# Altium project ECG_DAQ.PrjPcb
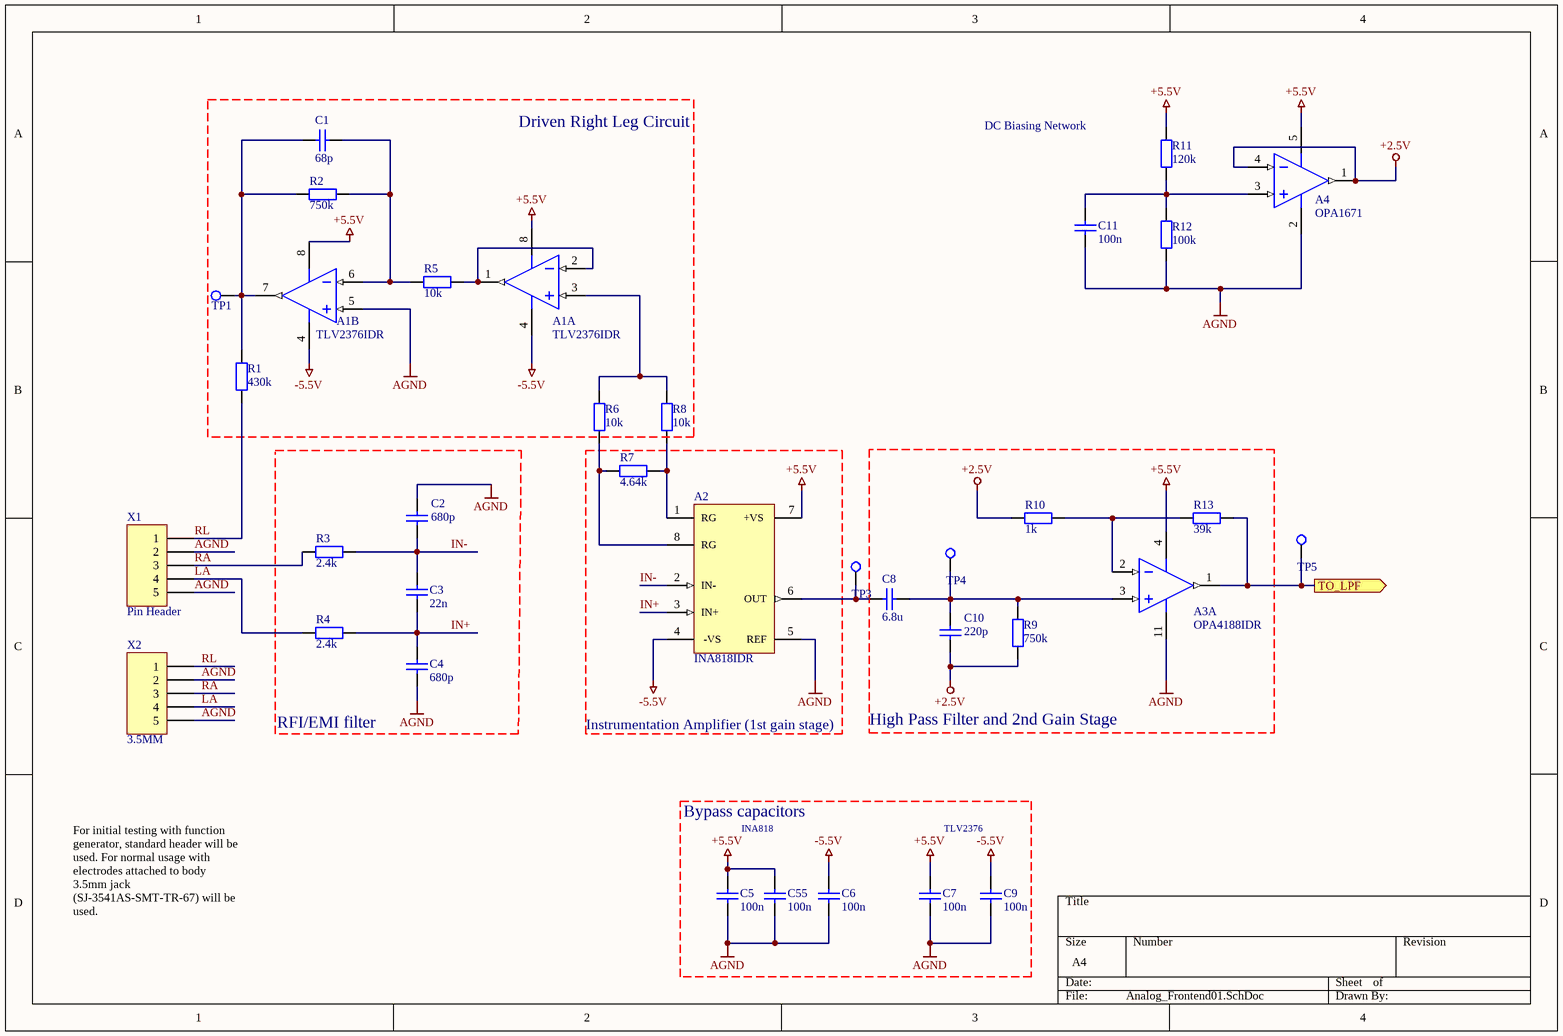
[diagram p0: Analog_Frontend01.SchDoc]
Desiger/Author: Dino Cindric; PCB Layers: 4; PCB Manufacturer 1: JLCPCB; PCB Manufacturer 2: PCBWay; Project Name: ECG Data Acquisition System; Year: 2020
6 sheets, 146 parts. Net scope: flat (ports and power ports of the same name join across sheets).
Board file: ECG-DAQ.PcbDoc
Sheets:
  Analog_Frontend01.SchDoc
  Analog_Frontend02.SchDoc
  MCU.SchDoc
  Power supply.SchDoc
  ADC.SchDoc
  MCU_Supply.SchDoc

## Sheet Analog_Frontend01.SchDoc
size A4; DocumentNumber: 2; SheetNumber: 1; SheetTotal: 5

### Parts
A1  TLV2376IDR  [SOIC127P600X175-8N]  (parts A,B of 2)
A2  INA818IDR  [SOIC127P600X175-8N]
A3  OPA4188IDR  [SOIC127P600X175-14N]  (part A of 4)
A4  OPA1671  [SOT95P280X145-5N]
C1  68p  [CAPC1608X87N]
C2  680p  [CAPC2012X110N]
C3  22n  [CAPC3225X170N]
C4  680p  [CAPC2012X110N]
C5  100n  [CAPC1608X87N]
C6  100n  [CAPC1608X87N]
C7  100n  [CAPC1608X87N]
C8  6.8u  [CAPC2012X110N]
C9  100n  [CAPC1608X87N]
C10  220p  [CAPC1608X87N]
C11  100n  [CAPC1608X87N]
C55  100n  [CAPC1608X87N]
R1  430k  [RESC1608X55N]
R2  750k  [RESC1608X55N]
R3  2.4k  [RESC2012X70N]
R4  2.4k  [RESC2012X70N]
R5  10k  [RESC1608X55N]
R6  10k  [RESC1608X55N]
R7  4.64k  [RESC1608X55N]
R8  10k  [RESC1608X55N]
R9  750k  [RESC1608X55N]
R10  1k  [RESC1608X55N]
R11  120k  [RESC1608X55N]
R12  100k  [RESC1608X55N]
R13  39k  [RESC1608X55N]
TP1  TP  [TEST-POINT]  (value not drawn)  (no BOM)
TP3  TP  [TEST-POINT]  (value not drawn)  (no BOM)
TP4  TP  [TEST-POINT]  (value not drawn)  (no BOM)
TP5  TP  [TEST-POINT]  (value not drawn)  (no BOM)
X1  Pin Header  [SHDR5W64P0X250_1X5_1496X650X700P]
X2  3.5MM  [SJ23574ASMTTR]

### Blocks framed on the sheet
Driven Right Leg Circuit: A1 C1 R1 R2 R5 R6 R8 TP1
RFI/EMI filter: C2-C4 R3 R4
Instrumentation Amplifier (1st gain stage): A2 R7
High Pass Filter and 2nd Gain Stage: A3 C8 C10 R9 R10 R13 TP4
Bypass capacitors: C5-C7 C9 C55

### Ports
TO_LPF (out)

### Nets
+2.5V: A4.1(OUT) A4.4(IN-) C10.1 R9.1 R10.1
+5.5V: A1.8(+V) A2.7(+VS) A3.4(+V) A4.5(V+) C5.2 C7.2 C55.2 R11.1
-5.5V: A1.4(-V) A2.4(-VS) C6.2 C9.2
AGND: A1.5(+IN) A2.5(REF) A3.11(-V) A4.2(V-) C2.2 C4.1 C5.1 C6.1 C7.1 C9.1 C11.1 C55.1 R12.2 X1.2 X1.5 X2.2 X2.5
IN+: A2.3(IN+) C3.1 C4.2 R4.2
IN-: A2.2(IN-) C2.1 C3.2 R3.2
LA: R4.1 X1.4 X2.4
RA: R3.1 X1.3 X2.3
RL: R1.1 X1.1 X2.1
NetA1_1: A1.1(OUT) A1.2(-IN) R5.2
NetA1_3: A1.3(+IN) R6.2 R8.2
NetA1_6: A1.6(-IN) C1.1 R2.2 R5.1
NetA1_7: A1.7(OUT) C1.2 R1.2 R2.1 TP1.0
NetA2_1: A2.1(RG) R7.2 R8.1
NetA2_6: A2.6(OUT) C8.2 TP3.0
NetA2_8: A2.8(RG) R6.1 R7.1
NetA3_1: A3.1(OUT_A) R13.2 TP5.0 ; port TO_LPF
NetA3_2: A3.2(-IN_A) R10.2 R13.1
NetA3_3: A3.3(+IN_A) C8.1 C10.2 R9.2 TP4.0
NetA4_3: A4.3(IN+) C11.2 R11.2 R12.1

### Notes on the sheet
- DC Biasing Network
- INA818
- TLV2376
- For initial testing with function generator, standard header will be used. For normal usage with electrodes attached to body 3.5mm jack (SJ-3541AS-SMT-TR-67) will be used.

### Library data of the parts
A1 = AD706AR: Manufacturer 1: Texas Instruments; Manufacturer Part Number 1: TLV2376IDR
A2 = INAMP: Manufacturer 1: Texas Instruments; Manufacturer Part Number 1: INA818IDR; MOUSER Part Number: 595-INA818IDR
A3 = AD824ARZ-14-3V-RL: Manufacturer 1: Texas Instruments; Manufacturer Part Number 1: OPA4188AIDR
A4 = OPA336NJ/250: Manufacturer 1: Texas Instruments; Manufacturer Part Number 1: OPA1671IDBVR
C1 = Cap: Manufacturer 1: KEMET; Manufacturer Part Number 1: C0603C680M5HACTU
C2 C4 = Cap: Manufacturer 1: Panasonic; Manufacturer Part Number 1: ECH-U1H681GX5; MOUSER Part Number: 667-ECH-U1H681GX5
C3 = Cap: Manufacturer 1: Panasonic; Manufacturer Part Number 1: ECH-U1H223GX5; MOUSER Part Number: 667-ECH-U1H223GX5
C5-C7 C9 C11 = Cap: Manufacturer 1: Taiyo Yuden; Manufacturer Part Number 1: EMK107B7104KA-T
C8 = Cap: Manufacturer 1: TDK; Manufacturer Part Number 1: C2012X6S1C685M125AC
C10 = Cap: Manufacturer 1: Vishay/Vitramon; Manufacturer Part Number 1: VJ0603Y221KXJPW1BC
C55 = Cap: Capacitor; Manufacturer 1: Taiyo Yuden; Manufacturer Part Number 1: EMK107B7104KA-T
R1 = Res2: Manufacturer 1: Bourns; Manufacturer Part Number 1: CR0603-FX-4303ELF
R2 R9 = Res2: Manufacturer 1: Bourns; Manufacturer Part Number 1: CR0603-FX-7503ELF
R3 R4 = Res2: Manufacturer 1: Panasonic; Manufacturer Part Number 1: ERJ-6ENF2401V; MOUSER Part Number: 667-ERJ-6ENF2401V
R5 R6 R8 = Res2: Manufacturer 1: Yageo; Manufacturer Part Number 1: RC0603FR-0710KL; MOUSER Part Number: 603-RC0603FR-0710KL
R7 = Res2: Manufacturer 1: Bourns; Manufacturer Part Number 1: CR0603-FX-4641ELF
R10 = Res2: Manufacturer 1: Yageo; Manufacturer Part Number 1: RC0603FR-071KL
R11 = Res2: Manufacturer 1: Bourns; Manufacturer Part Number 1: CR0603-FX-1203ELF
R12 = Res2: Manufacturer 1: Panasonic; Manufacturer Part Number 1: ERJ-3EKF1003V
R13 = Res2: Manufacturer 1: Bourns; Manufacturer Part Number 1: CR0603-FX-3902ELF
TP1 TP3-TP5 = TEST_POINT: Generic test point
X1 = Header 5: Header, 5-Pin; Manufacturer 1: Molex; Manufacturer Part Number 1: 35312-0560
X2 = Header 5: Header, 5-Pin; Manufacturer 1: CUI Devices; Manufacturer Part Number 1: SJ-3541AS-SMT-TR-67

## Sheet Analog_Frontend02.SchDoc
size A4; DocumentNumber: 3; SheetNumber: 2; SheetTotal: 5
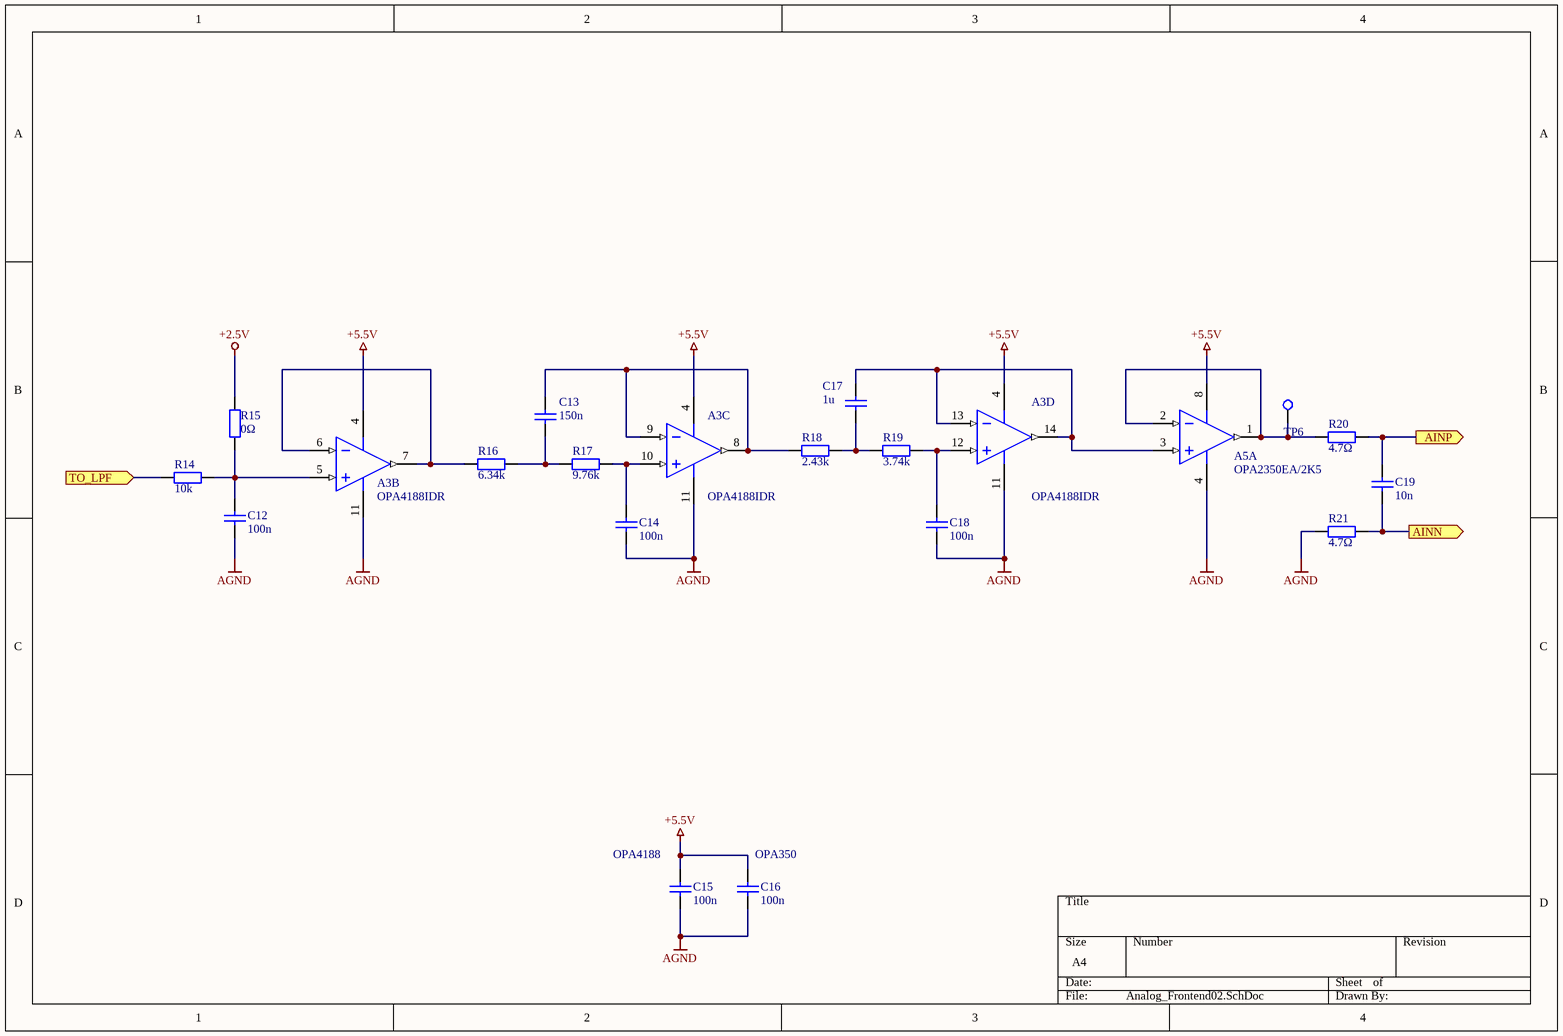
[diagram p1: Analog_Frontend02.SchDoc]

### Parts
A3  OPA4188IDR  [SOIC127P600X175-14N]  (parts B,C,D of 4)
A5  OPA2350EA/2K5  [SOIC127P600X175-8N]  (part A of 2)
C12  100n  [CAPC1608X87N]
C13  150n  [CAPC1608X87N]
C14  100n  [CAPC1608X87N]
C15  100n  [CAPC1608X87N]
C16  100n  [CAPC1608X87N]
C17  1u  [CAPC1608X87N]
C18  100n  [CAPC1608X87N]
C19  10n  [CAPC1608X87N]
R14  10k  [RESC1608X55N]
R15  0Ω  [RESC1608X55N]
R16  6.34k  [RESC1608X55N]
R17  9.76k  [RESC1608X55N]
R18  2.43k  [RESC1608X55N]
R19  3.74k  [RESC1608X55N]
R20  4.7Ω  [RESC1608X55N]
R21  4.7Ω  [RESC1608X55N]
TP6  TP  [TEST-POINT]  (value not drawn)  (no BOM)

### Ports
AINN (out), AINP (out), TO_LPF (in)

### Nets
+2.5V: R15.2
+5.5V: A3.4(+V) A5.8(V+) C15.2 C16.2
AGND: A3.11(-V) A5.4(V-) C12.1 C14.1 C15.1 C16.1 C18.1 R21.1
NetA3_1: R14.1 ; port TO_LPF
NetA3_5: A3.5(+IN_B) C12.2 R14.2 R15.1
NetA3_6: A3.6(-IN_B) A3.7(OUT_B) R16.1
NetA3_8: A3.8(OUT_C) A3.9(-IN_C) C13.2 R18.1
NetA3_10: A3.10(+IN_C) C14.2 R17.2
NetA3_12: A3.12(+IN_D) C18.2 R19.2
NetA3_13: A3.13(-IN_D) A3.14(OUT_D) A5.3(IN_A+) C17.2
NetA5_1: A5.1(OUT_A) A5.2(IN_A-) R20.1 TP6.0
NetC13_1: C13.1 R16.2 R17.1
NetC17_1: C17.1 R18.2 R19.1
NetC19_1: C19.1 R21.2 ; port AINN
NetC19_2: C19.2 R20.2 ; port AINP

### Notes on the sheet
- (near C15) OPA4188
- (near C16) OPA350

### Library data of the parts
A3 = AD824ARZ-14-3V-RL: Manufacturer 1: Texas Instruments; Manufacturer Part Number 1: OPA4188IDR
A5 = OPA2350EA/250: Manufacturer 1: Texas Instruments; Manufacturer Part Number 1: OPA2350EA/2K5
C12 C14-C16 C18 = Cap: as C5 on sheet Analog_Frontend01
C13 = Cap: Manufacturer 1: Samsung Electro-Mechanics; Manufacturer Part Number 1: CL10B154KO8NNNC
C17 = Cap: Manufacturer 1: Taiyo Yuden; Manufacturer Part Number 1: EMK107BJ105KA-T
C19 = Cap: Manufacturer 1: KEMET; Manufacturer Part Number 1: C0603C103J4RACAUTO
R14 = Res2: as R5 on sheet Analog_Frontend01; MOUSER Part Number: 603-RC0603FR-0710KL
R15 = Res2: Manufacturer 1: Panasonic; Manufacturer Part Number 1: ERJ-3GEY0R00V
R16 = Res2: Manufacturer 1: Vishay/Dale; Manufacturer Part Number 1: CRCW06036K34FKEA
R17 = Res2: Manufacturer 1: Vishay/Dale; Manufacturer Part Number 1: CRCW06039K76FKEA
R18 = Res2: Manufacturer 1: Vishay/Dale; Manufacturer Part Number 1: CRCW06032K43FKEA
R19 = Res2: Manufacturer 1: Vishay/Dale; Manufacturer Part Number 1: CRCW06033K74FKEA
R20 R21 = Res2: Manufacturer 1: Vishay/Dale; Manufacturer Part Number 1: CRCW06034R70FKEAC
TP6 = TEST_POINT: Generic test point

## Sheet MCU.SchDoc
size A4; DocumentNumber: 4; SheetNumber: 3; SheetTotal: 5
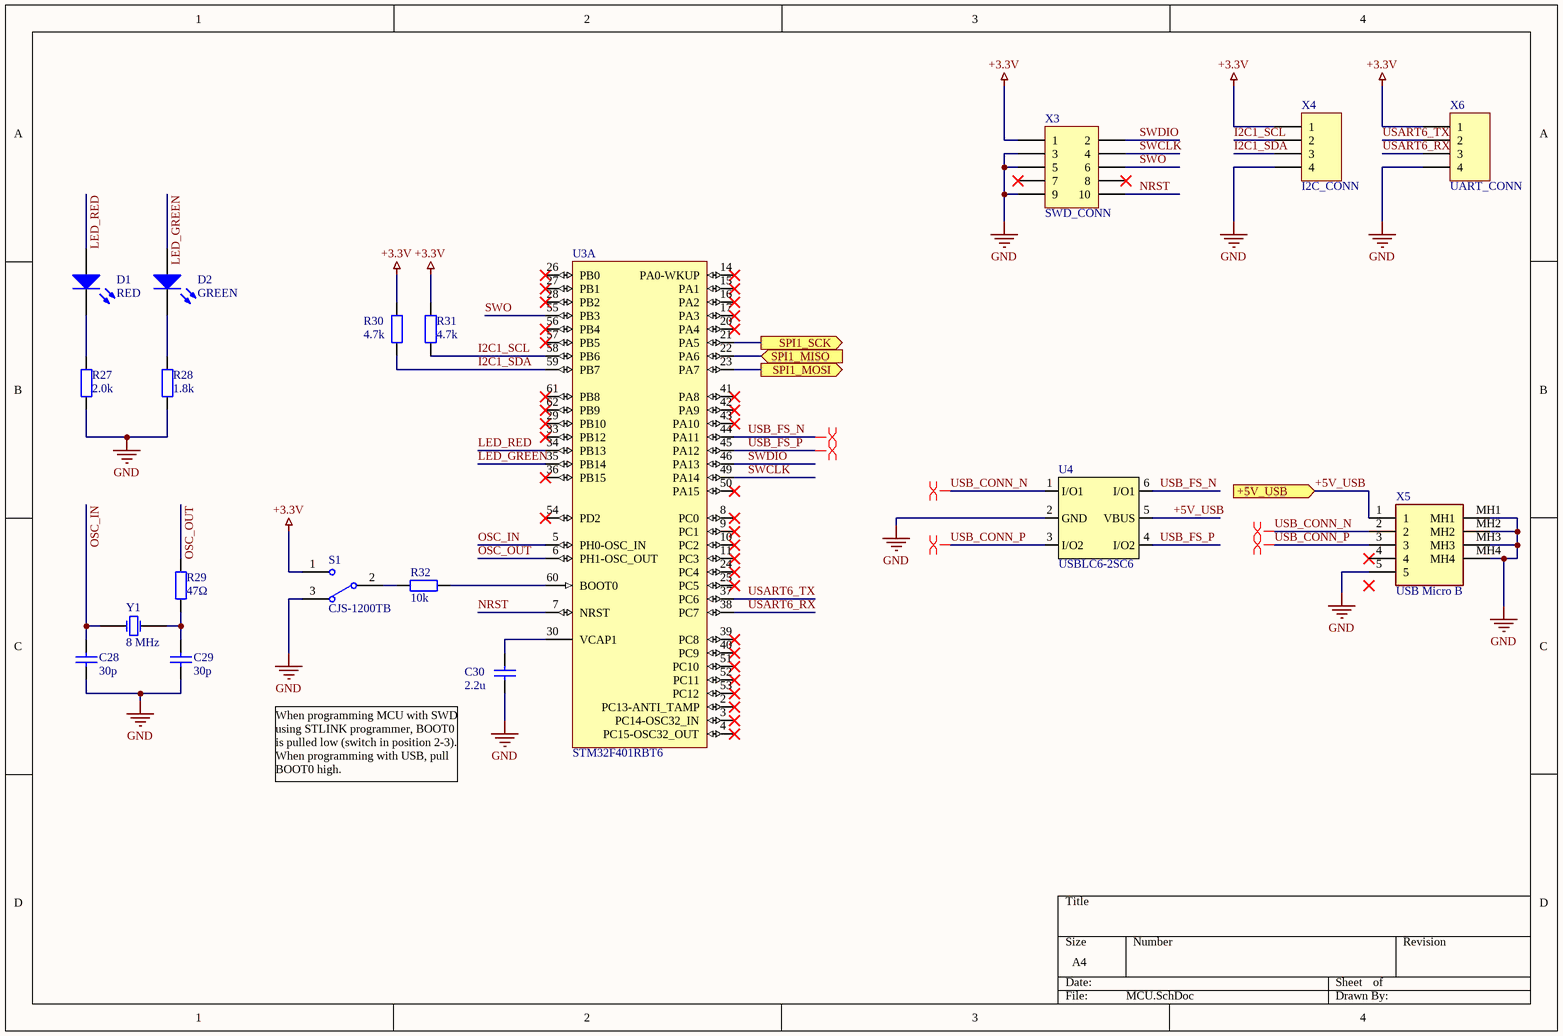
[diagram p2: MCU.SchDoc]

### Parts
C28  30p  [CAPC1608X87N]
C29  30p  [CAPC1608X87N]
C30  2.2u  [CAPC2012X110N]
D1  RED  [LEDC2012X110N]
D2  GREEN  [LEDC2012X110N]
R27  2.0k  [RESC1608X55N]
R28  1.8k  [RESC1608X55N]
R29  47Ω  [RESC1608X55N]
R30  4.7k  [RESC1608X55N]
R31  4.7k  [RESC1608X55N]
R32  10k  [RESC1608X55N]
S1  CJS-1200TB  [B-TYPE]
U3  STM32F401RBT6  [QFP50P1200X1200X160-64N]  (part A of 2)
U4  USBLC6-2SC6  [SOT95P280X145-6N]
X3  SWD_CONN  [SHDR10W55P200_2X5_1265X630X640P]
X4  I2C_CONN  [SHDR4W65P0X254_1X4_1262X660X1216P]
X5  USB Micro B  [UJ2MIBH24SMTTR]
X6  UART_CONN  [SHDR4W65P0X254_1X4_1262X660X1216P]
Y1  8 MHz  [ECS080185PXJESTR]

### Ports
+5V_USB (in), SPI1_MISO (in), SPI1_MOSI (out), SPI1_SCK (out)

### Nets
+3.3V: R30.2 R31.2 S1.1 X3.1 X4.1 X6.1
GND: C28.1 C29.1 C30.1 R27.1 R28.1 S1.3 U4.2(GND) X3.3 X3.5 X3.9 X4.4 X5.5 X5.MH1 X5.MH2 X5.MH3 X5.MH4 X6.4
+5V_USB: U4.5(VBUS) X5.1 ; port +5V_USB
I2C1_SCL: R31.1 U3.58(PB6) X4.2
I2C1_SDA: R30.1 U3.59(PB7) X4.3
LED_GREEN: D2.1(A) U3.35(PB14)
LED_RED: D1.1(A) U3.34(PB13)
NRST: U3.7(NRST) X3.10
OSC_IN: C28.2 U3.5(PH0-OSC_IN) Y1.1(OSC1)
OSC_OUT: R29.2 U3.6(PH1-OSC_OUT)
SWCLK: U3.49(PA14) X3.4
SWDIO: U3.46(PA13) X3.2
SWO: U3.55(PB3) X3.6
USART6_RX: U3.38(PC7) X6.3
USART6_TX: U3.37(PC6) X6.2
USB_CONN_N: U4.1(I/O1) X5.2
USB_CONN_P: U4.3(I/O2) X5.3
USB_FS_N: U3.44(PA11) U4.6(I/O1)
USB_FS_P: U3.45(PA12) U4.4(I/O2)
NetC29_2: C29.2 R29.1 Y1.2(OSC2)
NetC30_2: C30.2 U3.30(VCAP1)
NetD1_2: D1.2(K) R27.2
NetD2_2: D2.2(K) R28.2
NetR25_2: U3.21(PA5) ; port SPI1_SCK
NetR26_2: U3.23(PA7) ; port SPI1_MOSI
NetR32_1: R32.1 U3.60(BOOT0)
NetR32_2: R32.2 S1.2
NetU2_7: U3.22(PA6) ; port SPI1_MISO

Not connected (* = marked no-connect by the designer): U3 2(PC13-ANTI_TAMP)* 3(PC14-OSC32_IN)* 4(PC15-OSC32_OUT)* 8(PC0)* 9(PC1)* 10(PC2)* 11(PC3)* 14(PA0-WKUP)* 15(PA1)* 16(PA2)* 17(PA3)* 20(PA4)* 24(PC4)* 25(PC5)* 26(PB0)* 27(PB1)* 28(PB2)* 29(PB10)* 33(PB12)* 36(PB15)* 39(PC8)* 40(PC9)* 41(PA8)* 42(PA9)* 43(PA10)* 50(PA15)* 51(PC10)* 52(PC11)* 53(PC12)* 54(PD2)* 56(PB4)* 57(PB5)* 61(PB8)* 62(PB9)*; X3 7* 8*; X5 4*

### Layout directives
differential pair: USB_CONN_N, USB_CONN_P, USB_FS_N, USB_FS_P

### Notes on the sheet
- When programming MCU with SWD using STLINK programmer, BOOT0 is pulled low (switch in position 2-3). When programming with USB, pull BOOT0 high.

### Library data of the parts
C28 C29 = Cap: Manufacturer 1: AVX; Manufacturer Part Number 1: 06035U300FAT2A
C30 = Cap: Manufacturer 1: Samsung Electro-Mechanics; Manufacturer Part Number 1: CL21B225KOFNNNE
D1 = LED1: Manufacturer 1: Lite-On; Manufacturer Part Number 1: LTST-C170CKT
D2 = LED1: Manufacturer 1: Lite-On; Manufacturer Part Number 1: LTST-C170KGKT
R27 = Res2: Manufacturer 1: Vishay/Dale; Manufacturer Part Number 1: CRCW06032K00FKEA
R28 = Res2: Manufacturer 1: Vishay/Dale; Manufacturer Part Number 1: CRCW060311K8FKEA
R29 = Res2
R30 R31 = Res2: Manufacturer 1: Vishay/Dale; Manufacturer Part Number 1: CRCW06034K70FKEA
R32 = Res2: as R5 on sheet Analog_Frontend01; MOUSER Part Number: 603-RC0603FR-0710KL
S1 = SW-SPDT
U3 = STM32F401RBT6: Manufacturer 1: STMicroelectronics; Manufacturer Part Number 1: STM32F401RBT6
U4 = USBLC6: Manufacturer 1: STMicroelectronics; Manufacturer Part Number 1: USBLC6-2SC6
X3 = Header 5X2: Manufacturer 1: Molex; Manufacturer Part Number 1: 87831-1019
X4 X6 = Header 4: Manufacturer 1: Molex; Manufacturer Part Number 1: 171971-0004
X5 = UJ2-MIBH2-4-SMT-TR: Connector; Manufacturer_Name: CUI Devices; Datasheet Link: https://componentsearchengine.com//UJ2-MIBH2-4-SMT-TR.pdf; Height: 2.5mm; Mouser2 Part Number: 490-UJ2-MIBH2-4-SMT; Mouser2 Price/Stock: https://www.mouser.com/Search/Refine.aspx?Keyword=490-UJ2-MIBH2-4-SMT; Manufacturer_Part_Number: UJ2-MIBH2-4-SMT-TR
Y1 = XTAL: Manufacturer 1: ECS; Manufacturer Part Number 1: ECS-080-18-5PX-JES-TR

## Sheet Power supply.SchDoc
size A4; DocumentNumber: 5; SheetNumber: 4; SheetTotal: 5
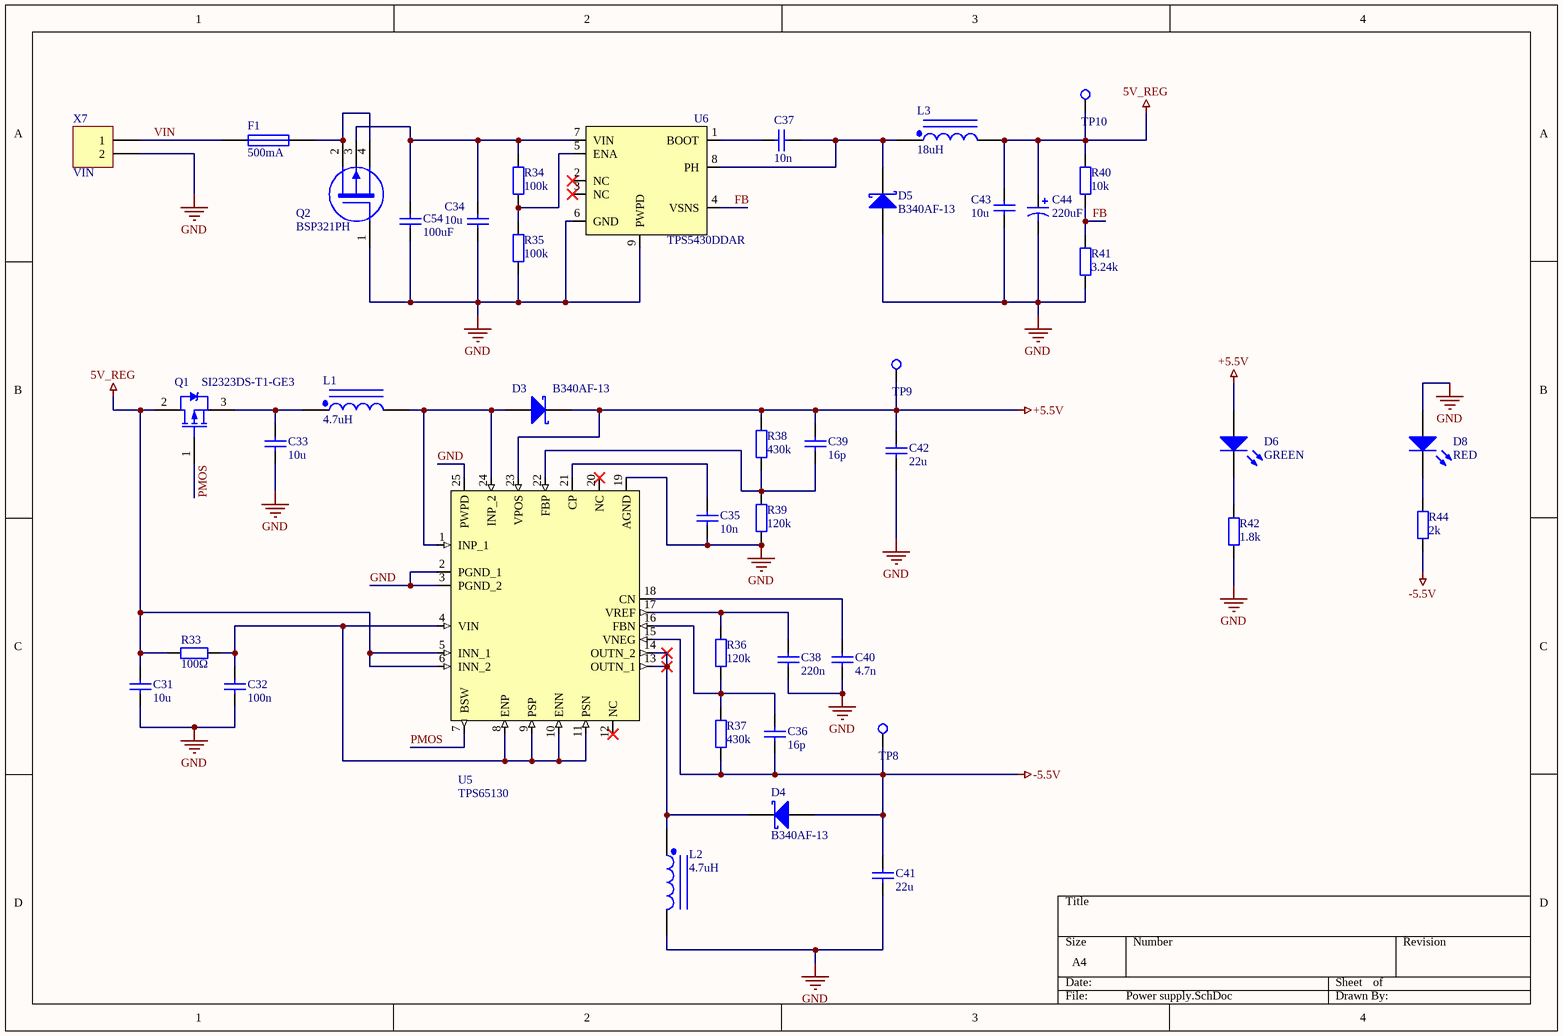
[diagram p3: Power supply.SchDoc]

### Parts
C31  10u  [CAPC2012X110N]
C32  100n  [CAPC1608X87N]
C33  10u  [CAPC2012X110N]
C34  10u  [CAPC2012X110N]
C35  10n  [CAPC1608X87N]
C36  16p  [CAPC1608X87N]
C37  10n  [CAPC1608X87N]
C38  220n  [CAPC1608X87N]
C39  16p  [CAPC1608X87N]
C40  4.7n  [CAPC1608X87N]
C41  22u  [CAPC3225X270N]
C42  22u  [CAPC3225X270N]
C43  10u  [CAPC2012X110N]
C44  220uF  [CAPPM7344X310N]
C54  100uF  [CAPAE1000X1050N]
D3  B340AF-13  [SODFL5226X110N]
D4  B340AF-13  [SODFL5226X110N]
D5  B340AF-13  [SODFL5226X110N]
D6  GREEN  [LEDC2012X110N]
D8  RED  [LEDC2012X110N]
F1  500mA  [RESC1608X55N]
L1  4.7uH  [B82462G4472M]
L2  4.7uH  [B82462G4472M]
L3  18uH  [SRR4828A180M]
Q1  SI2323DS-T1-GE3  [SOT95P237X112-3N]
Q2  BSP321PH  [SOT230P700X170-4N]
R33  100Ω  [RESC1608X55N]
R34  100k  [RESC1608X55N]
R35  100k  [RESC1608X55N]
R36  120k  [RESC1608X55N]
R37  430k  [RESC1608X55N]
R38  430k  [RESC1608X55N]
R39  120k  [RESC1608X55N]
R40  10k  [RESC1608X55N]
R41  3.24k  [RESC1608X55N]
R42  1.8k  [RESC1608X55N]
R44  2k  [RESC1608X55N]
TP8  TP  [TEST-POINT]  (value not drawn)  (no BOM)
TP9  TP  [TEST-POINT]  (value not drawn)  (no BOM)
TP10  TP  [TEST-POINT]  (value not drawn)  (no BOM)
U5  TPS65130  [QFN50P400X400X100-25N-D]
U6  TPS5430DDAR  [SOIC127P600X170-9N]
X7  VIN  [SHDR2W100P0X500_1X2_1120X800X1100P]

### Nets
5V_REG: C31.2 C43.2 C44.1 L3.2 Q1.2(D) R33.1 R40.2 TP10.0 U5.5(INN_1) U5.6(INN_2)
+5.5V: C39.2 C42.2 D3.2(K) D6.1(A) R38.2 TP9.0 U5.23(VPOS)
-5.5V: C36.1 C41.2 D4.1(A) R37.1 R44.1 TP8.0 U5.15(VNEG)
GND: C31.1 C32.1 C33.1 C34.1 C35.1 C38.1 C40.1 C41.1 C42.1 C43.1 C44.2 C54.1 D5.1(A) D8.1(A) L2.2 Q2.1(G) R35.1 R39.1 R41.1 R42.2 U5.2(PGND_1) U5.3(PGND_2) U5.19(AGND) U5.25(PWPD) U6.6(GND) U6.9(PWPD) X7.2
FB: R40.1 R41.2 U6.4(VSNS)
PMOS: Q1.1(G) U5.7(BSW)
VIN: F1.2 X7.1
NetC32_2: C32.2 R33.2 U5.4(VIN) U5.8(ENP) U5.9(PSP) U5.10(ENN) U5.11(PSN)
NetC33_2: C33.2 L1.1 Q1.3(S)
NetC34_2: C34.2 C54.2 Q2.3(U) R34.2 U6.7(VIN)
NetC35_2: C35.2 U5.21(CP)
NetC36_2: C36.2 R36.1 R37.2 U5.16(FBN)
NetC37_1: C37.1 U6.1(BOOT)
NetC37_2: C37.2 D5.2(K) L3.1 U6.8(PH)
NetC38_2: C38.2 R36.2 U5.17(VREF)
NetC39_1: C39.1 R38.1 R39.2 U5.22(FBP)
NetC40_2: C40.2 U5.18(CN)
NetD3_1: D3.1(A) L1.2 U5.1(INP_1) U5.24(INP_2)
NetD4_2: D4.2(K) L2.1 U5.13(OUTN_1) U5.14(OUTN_2)
NetD6_2: D6.2(K) R42.1
NetD8_2: D8.2(K) R44.2
NetF1_1: F1.1 Q2.2(D) Q2.4(S)
NetR34_1: R34.1 R35.2 U6.5(ENA)

Not connected (* = marked no-connect by the designer): U5 12(NC)* 20(NC)*; U6 2(NC)* 3(NC)*

### Library data of the parts
C31 C33 C34 C43 = Cap: Manufacturer 1: Taiyo Yuden; Manufacturer Part Number 1: EMK212BB7106KG-T
C32 = Cap
C35 C37 = Cap: as C19 on sheet Analog_Frontend02
C36 C39 = Cap: Manufacturer 1: Taiyo Yuden; Manufacturer Part Number 1: AC0603JRNPO9BN160
C38 = Cap: Manufacturer 1: KEMET; Manufacturer Part Number 1: C0603C224J4RECTU
C40 = Cap: Manufacturer 1: KEMET; Manufacturer Part Number 1: C0603C472J5RACTU
C41 C42 = Cap: Manufacturer 1: Taiyo Yuden; Manufacturer Part Number 1: TMK325B7226MMHP
C44 = Cap Pol1: Manufacturer 1: AVX; Manufacturer Part Number 1: TPSD227M016R0200V
C54 = Cap: Capacitor; Manufacturer 1: Panasonic; Manufacturer Part Number 1: EEE-FC1V101P
D3-D5 = D Schottky: Manufacturer 1: Diodes Incorporated; Manufacturer Part Number 1: B340AF-13
D6 = LED1: as D2 on sheet MCU
D8 = LED1: as D1 on sheet MCU
F1 = Fuse 1: Manufacturer 1: Busmann/Eaton; Manufacturer Part Number 1: CC06FA500MA-TR
L1 L2 = Inductor Iron Dot: Manufacturer 1: EPCOS/TDK; Manufacturer Part Number 1: B82462G4472M
L3 = Inductor Iron Dot: Manufacturer 1: Bourns; Manufacturer Part Number 1: SRR4828A-180M
Q1 = PMOS-2: Manufacturer 1: Vishay Semiconductor; Manufacturer Part Number 1: SI2323DS-T1-GE3
Q2 = MOSFET-P4: P-Channel MOSFET, Externally Terminated Substrate; Manufacturer 1: Infineon; Manufacturer Part Number 1: BSP321PH
R33 = Res2: Manufacturer 1: Vishay/Dale; Manufacturer Part Number 1: CRCW0603100RFKEAC
R34 R35 = Res2: as R12 on sheet Analog_Frontend01
R36 R39 = Res2: as R11 on sheet Analog_Frontend01
R37 R38 = Res2: as R1 on sheet Analog_Frontend01
R40 = Res2: as R5 on sheet Analog_Frontend01; MOUSER Part Number: 603-RC0603FR-0710KL
R41 = Res2: Manufacturer 1: Vishay/Dale; Manufacturer Part Number 1: CRCW06033K24FKEA
R42 = Res2: as R28 on sheet MCU
R44 = Res2: as R27 on sheet MCU
TP8-TP10 = TEST_POINT: Generic test point
U5 = TPS65130: Manufacturer 1: Texas Instruments; Manufacturer Part Number 1: TPS65130RGER
U6 = TPS5430: Manufacturer 1: Texas Instruments; Manufacturer Part Number 1: TPS5430DDAR
X7 = Header 2: Manufacturer 1: Wurth Elektronik; Manufacturer Part Number 1: 691111710002

## Sheet ADC.SchDoc
size A4; DocumentNumber: 1; SheetNumber: 5; SheetTotal: 5
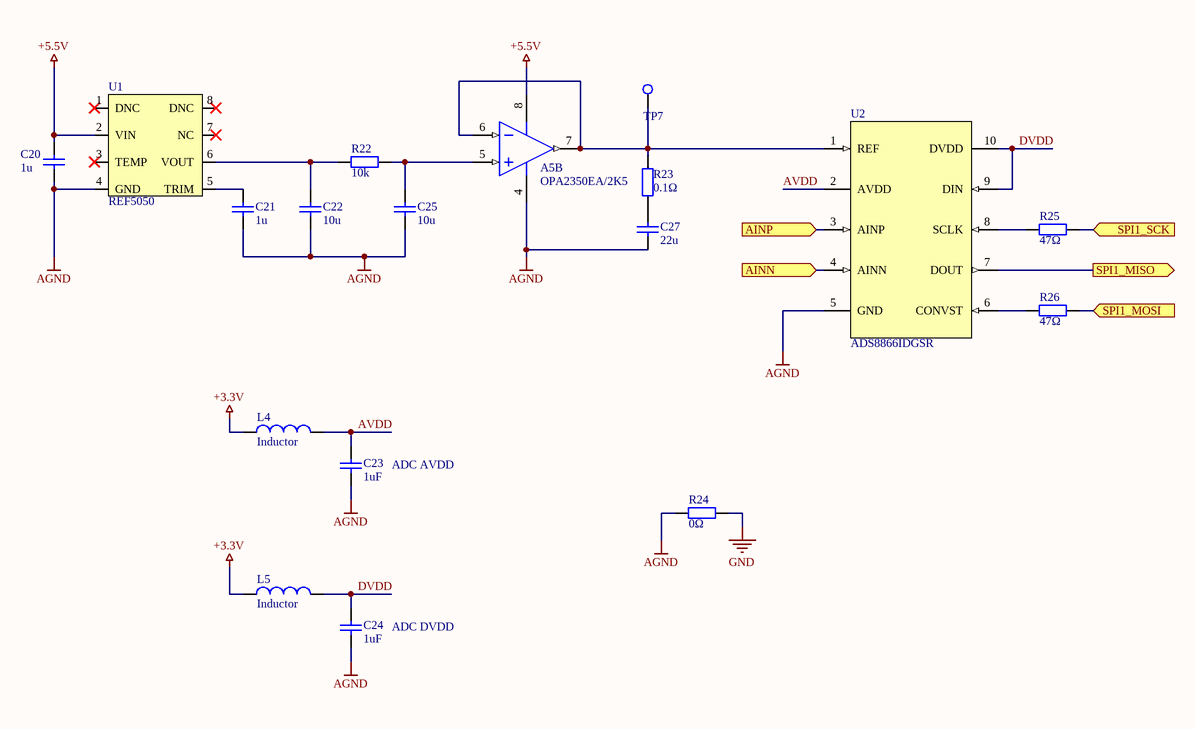
[diagram p4: ADC.SchDoc]

### Parts
A5  OPA2350EA/2K5  [SOIC127P600X175-8N]  (part B of 2)
C20  1u  [CAPC1608X87N]
C21  1u  [CAPC1608X87N]
C22  10u  [CAPC2012X110N]
C23  1uF  [CAPC1608X87N]
C24  1uF  [CAPC1608X87N]
C25  10u  [CAPC2012X110N]
C27  22u  [CAPC2012X110N]
L4  Inductor  [RESC1608X55N]
L5  Inductor  [INDC1608L]
R22  10k  [RESC1608X55N]
R23  0.1Ω  [RESC1608X55N]
R24  0Ω  [RESC1608X55N]
R25  47Ω  [RESC1608X55N]
R26  47Ω  [RESC1608X55N]
TP7  TP  [TEST-POINT]  (value not drawn)  (no BOM)
U1  REF5050  [SOIC127P600X175-8N]
U2  ADS8866IDGSR  [SOP50P490X110-10N]

### Ports
AINN (in), AINP (in), SPI1_MISO (out), SPI1_MOSI (in), SPI1_SCK (in)

### Nets
+3.3V: L4.1 L5.1
+5.5V: A5.8(V+) C20.2 U1.2(VIN)
AGND: A5.4(V-) C20.1 C21.1 C22.1 C23.1 C24.1 C25.1 C27.2 R24.1 U1.4(GND) U2.5(GND)
GND: R24.2
AVDD: C23.2 L4.2 U2.2(AVDD)
DVDD: C24.2 L5.2 U2.9(DIN) U2.10(DVDD)
NetA5_5: A5.5(IN_B+) C25.2 R22.2
NetA5_6: A5.6(IN_B-) A5.7(OUT_B) R23.2 TP7.0 U2.1(REF)
NetC19_1: U2.4(AINN) ; port AINN
NetC19_2: U2.3(AINP) ; port AINP
NetC21_2: C21.2 U1.5(TRIM)
NetC22_2: C22.2 R22.1 U1.6(VOUT)
NetC27_1: C27.1 R23.1
NetR25_1: R25.1 U2.8(SCLK)
NetR25_2: R25.2 ; port SPI1_SCK
NetR26_1: R26.1 U2.6(CONVST)
NetR26_2: R26.2 ; port SPI1_MOSI
NetU2_7: U2.7(DOUT) ; port SPI1_MISO

Not connected (* = marked no-connect by the designer): U1 1(DNC)* 3(TEMP)* 7(NC)* 8(DNC)*

### Notes on the sheet
- (near C23) ADC AVDD
- (near C24) ADC DVDD

### Library data of the parts
A5 = OPA2350EA/250: Manufacturer 1: Texas Instruments; Manufacturer Part Number 1: OPA2350EA/2K5
C20 C21 C23 C24 = Cap: as C17 on sheet Analog_Frontend02
C22 C25 C27 = Cap: as C31 on sheet Power supply
R22 = Res2: as R5 on sheet Analog_Frontend01; MOUSER Part Number: 603-RC0603FR-0710KL
R23 = Res2: Manufacturer 1: Wurth Elektronik; Manufacturer Part Number 1: 560050316001
R24 = Res2: as R15 on sheet Analog_Frontend02
R25 R26 = Res2: Manufacturer 1: Vishay/Dale; Manufacturer Part Number 1: CRCW060347R0JNEAC
TP7 = TEST_POINT: Generic test point
U1 = REF5050: Manufacturer 1: Texas Instruments; Manufacturer Part Number 1: REF5050AIDR
U2 = AD8866: Manufacturer 1: Texas Instruments; Manufacturer Part Number 1: ADS8866IDGSR
L4 L5 = Inductor
  L4: Manufacturer 1: *; Manufacturer Part Number 1: *

## Sheet MCU_Supply.SchDoc
size A4
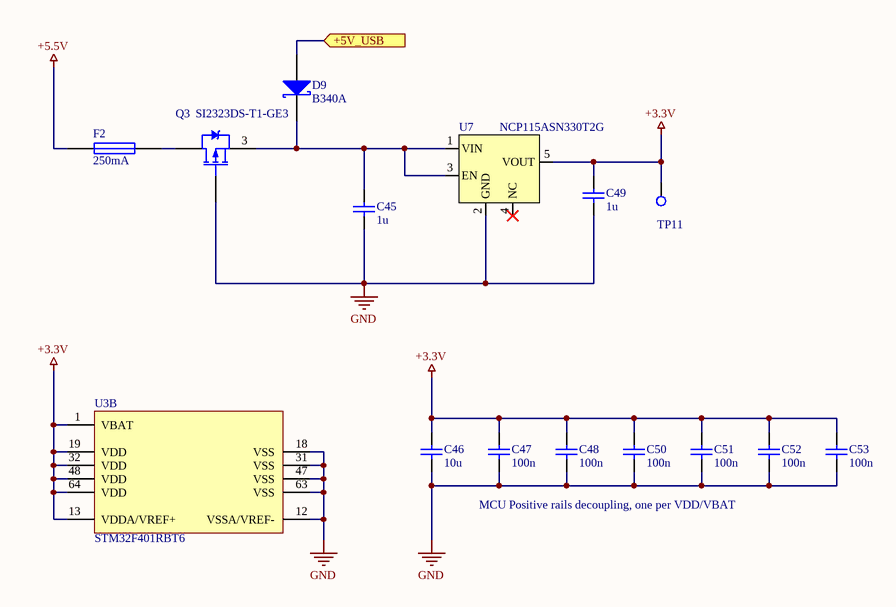
[diagram p5: MCU_Supply.SchDoc]

### Parts
C45  1u  [CAPC1608X87N]
C46  10u  [CAPC2012X110N]
C47  100n  [CAPC1608X87N]
C48  100n  [CAPC1608X87N]
C49  1u  [CAPC1608X87N]
C50  100n  [CAPC1608X87N]
C51  100n  [CAPC1608X87N]
C52  100n  [CAPC1608X87N]
C53  100n  [CAPC1608X87N]
D9  B340A  [SODFL5226X110N]
F2  250mA  [RESC1608X55N]
Q3  SI2323DS-T1-GE3  [SOT95P237X112-3N]
TP11  TP  [TEST-POINT]  (value not drawn)  (no BOM)
U3  STM32F401RBT6  [QFP50P1200X1200X160-64N]  (part B of 2)
U7  NCP115ASN330T2G  [SOT95P280X145-5N]

### Ports
+5V_USB (in)

### Nets
+3.3V: C46.2 C47.1 C48.2 C49.2 C50.2 C51.2 C52.2 C53.2 TP11.0 U3.1(VBAT) U3.13(VDDA/VREF+) U3.19(VDD) U3.32(VDD) U3.48(VDD) U3.64(VDD) U7.5(VOUT)
+5.5V: F2.1
GND: C45.1 C46.1 C47.2 C48.1 C49.1 C50.1 C51.1 C52.1 C53.1 Q3.1(G) U3.12(VSSA/VREF-) U3.18(VSS) U3.31(VSS) U3.47(VSS) U3.63(VSS) U7.2(GND)
+5V_USB: D9.1(A) ; port +5V_USB
NetC45_2: C45.2 D9.2(K) Q3.3(S) U7.1(VIN) U7.3(EN)
NetF2_2: F2.2 Q3.2(D)

Not connected (* = marked no-connect by the designer): U7 4(NC)*

### Notes on the sheet
- MCU Positive rails decoupling, one per VDD/VBAT

### Library data of the parts
C45 C49 = Cap: as C17 on sheet Analog_Frontend02
C46 = Cap: as C31 on sheet Power supply
C47 C48 C50-C53 = Cap: as C5 on sheet Analog_Frontend01
D9 = D Schottky
F2 = Fuse 1: Manufacturer 1: Bourns; Manufacturer Part Number 1: SF-0603FP025F-2
Q3 = PMOS-2
TP11 = TEST_POINT: Generic test point
U7 = NCP115: Manufacturer 1: ON Semiconductor; Manufacturer Part Number 1: NCP115ASN330T2G

## Nets that join several sheets
+2.5V: Analog_Frontend01 (5 pins), Analog_Frontend02 (R15.2)
+3.3V: MCU (6 pins), ADC (L4.1 L5.1), MCU_Supply (16 pins)
+5.5V: Analog_Frontend01 (8 pins), Analog_Frontend02 (A3.4 A5.8 C15.2 C16.2), Power supply (7 pins), ADC (A5.8 C20.2 U1.2), MCU_Supply (F2.1)
-5.5V: Analog_Frontend01 (A1.4 A2.4 C6.2 C9.2), Power supply (7 pins)
AGND: Analog_Frontend01 (17 pins), Analog_Frontend02 (8 pins), ADC (11 pins)
GND: MCU (17 pins), Power supply (27 pins), ADC (R24.2), MCU_Supply (16 pins)
+5V_USB: MCU (U4.5 X5.1), MCU_Supply (D9.1)
NetA3_1: Analog_Frontend01 (A3.1 R13.2 TP5.0), Analog_Frontend02 (R14.1)
NetC19_1: Analog_Frontend02 (C19.1 R21.2), ADC (U2.4)
NetC19_2: Analog_Frontend02 (C19.2 R20.2), ADC (U2.3)
NetR25_2: MCU (U3.21), ADC (R25.2)
NetR26_2: MCU (U3.23), ADC (R26.2)
NetU2_7: MCU (U3.22), ADC (U2.7)